# Altium schematic sheet ST_LINK_V2-1.SCHDOC: ST-LINK/V2-1
size A4; DocumentNumber: MB1248; Revision: A.2; SheetNumber: 11; SheetTotal: 14; Project: STM32H7-DK
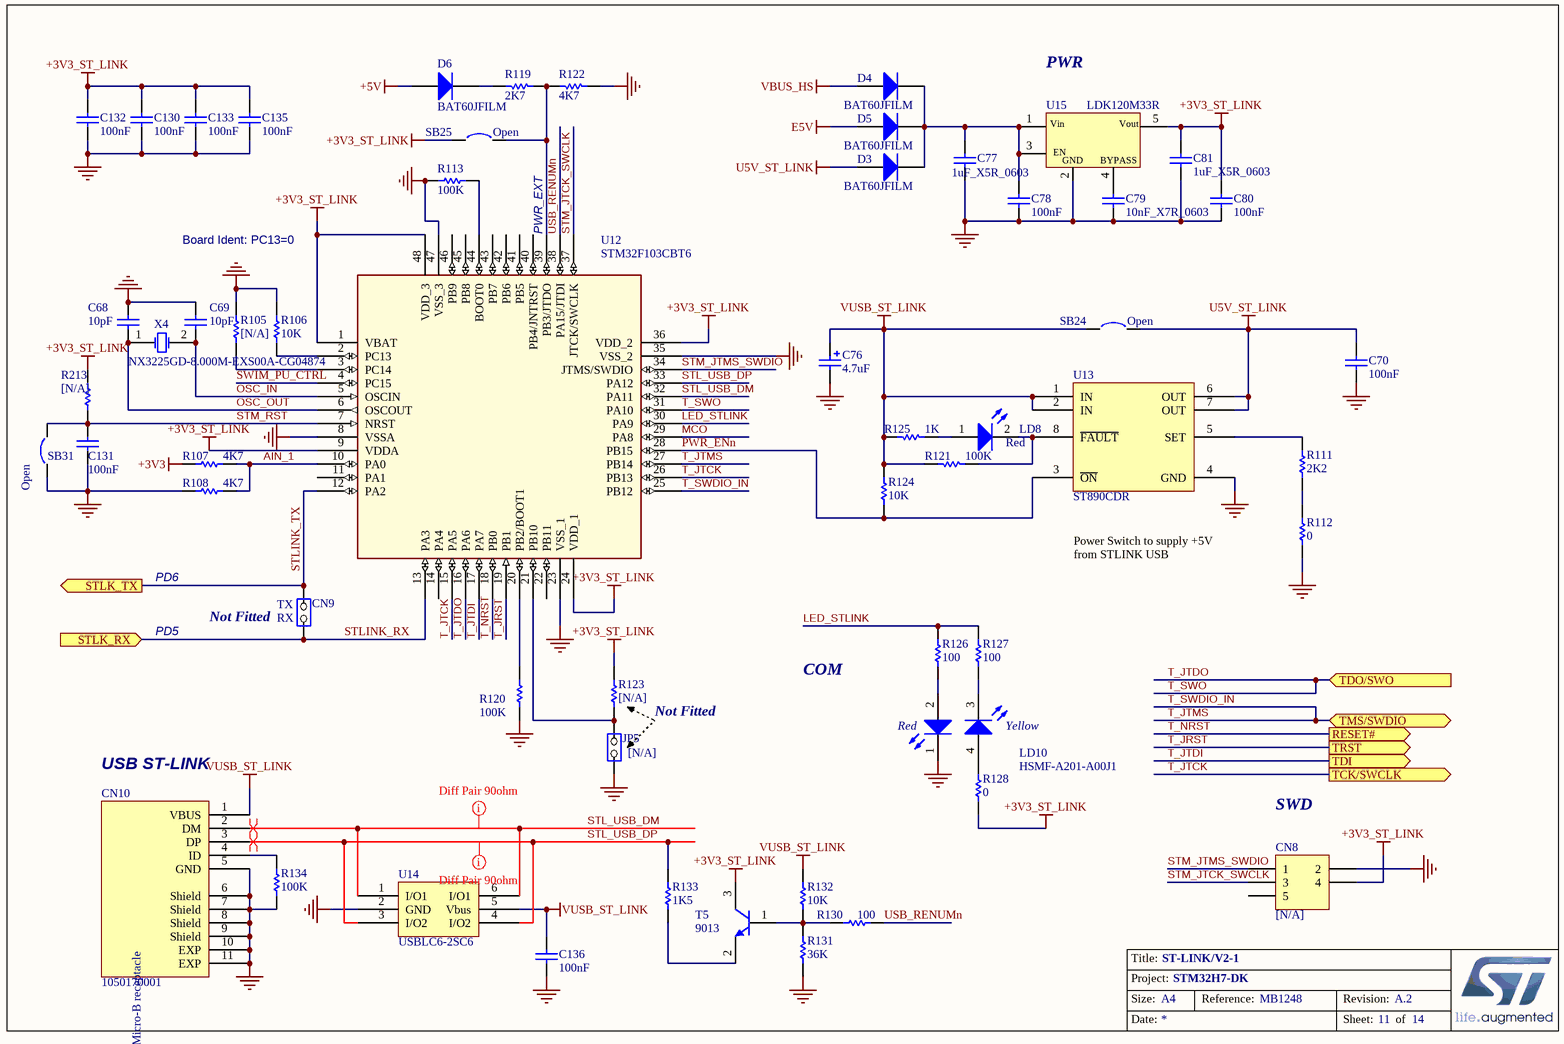
[diagram p0: ST_LINK_V2-1.SCHDOC]

## Parts
C68  10pF  [0603C]
C69  10pF  [0603C]
C70  100nF  [0603C]
C76  4.7uF  [TAN-A]
C77  1uF_X5R_0603  [0603C]
C78  100nF  [0603C]
C79  10nF_X7R_0603  [0603C]
C80  100nF  [0603C]
C81  1uF_X5R_0603  [0603C]
C130  100nF  [0603C]
C131  100nF  [0603C]
C132  100nF  [0603C]
C133  100nF  [0603C]
C135  100nF  [0603C]
C136  100nF  [0603C]
CN8  [N/A]  [HDR_2X3-1_2R54-6]
CN9  [N/A]  [SIP2]  (value not drawn)
CN10  1050170001  [MICRO_USB_B_105017]
D3  BAT60JFILM  [SOD-323]
D4  BAT60JFILM  [SOD-323]
D5  BAT60JFILM  [SOD-323]
D6  BAT60JFILM  [SOD-323]
JP5  [N/A]  [SIP2]
LD8  Red  [0603D]
LD10  HSMF-A201-A00J1  [LED2_3528]
R105  [N/A]  [0603R]
R106  10K  [0603R]
R107  4K7  [0603R]
R108  4K7  [0603R]
R111  2K2  [0402R]
R112  0  [0603R]
R113  100K  [0603R]
R119  2K7  [0603R]
R120  100K  [0603R]
R121  100K  [0603R]
R122  4K7  [0603R]
R123  [N/A]  [0603R]
R124  10K  [0402R]
R125  1K  [0603R]
R126  100  [0603R]
R127  100  [0603R]
R128  0  [0603R]
R130  100  [0603R]
R131  36K  [0603R]
R132  10K  [0603R]
R133  1K5  [0603R]
R134  100K  [0603R]
R213  [N/A]  [0603R]
SB24  Open  [SB_0603]
SB25  Open  [SB_0603]
SB31  Open  [SB_0603]
T5  9013  [SOT-23]
U12  STM32F103CBT6  [LQFP48_0R5_9X9]
U13  ST890CDR  [SOIC8_1R27_4R9X6]
U14  USBLC6-2SC6  [SOT23-6L]
U15  LDK120M33R  [SOT23-5]
X4  NX3225GD-8.000M-EXS00A-CG04874  [XTAL_2SM_3R2X2R5_H1]

## Ports
RESET# (out), STLK_RX (in), STLK_TX (out), TCK/SWCLK (out), TDI (out), TDO/SWO (in), TMS/SWDIO (bidir), TRST (out)

## Nets
+3V3: R107.1
+3V3_ST_LINK: C80.2 C81.1 C130.2 C132.2 C133.2 C135.2 CN8.4 R123.1 R128.2 R213.2 SB25.1 T5.3(C) U12.1(VBAT) U12.9(VDDA) U12.24(VDD_1) U12.36(VDD_2) U12.48(VDD_3) U15.5(Vout)
+5V: D6.1(A)
E5V: D5.1(A)
GND: C68.2 C69.2 C70.1 C76.2 C77.1 C78.1 C79.1 C80.1 C81.2 C130.1 C131.1 C132.1 C133.1 C135.1 C136.1 CN8.2 CN10.5(GND) CN10.6(Shield) CN10.7(Shield) CN10.8(Shield) CN10.9(Shield) CN10.10(EXP) CN10.11(EXP) JP5.1(COMMON) LD10.1(RED_cathode) R105.1 R106.1 R108.1 R112.1 R113.1 R120.1 R122.2 R131.1 R134.2 SB31.1 U12.8(VSSA) U12.23(VSS_1) U12.35(VSS_2) U12.47(VSS_3) U13.4(GND) U14.2(GND) U15.2(GND)
U5V_ST_LINK: C70.2 D3.1(A) SB24.2 U13.6(OUT) U13.7(OUT)
VBUS_HS: D4.1(A)
VUSB_ST_LINK: C76.1 C136.2 CN10.1(VBUS) R121.1 R124.1 R125.1 R132.2 SB24.1 U13.1(IN) U13.2(IN) U14.5(Vbus)
AIN_1: R107.2 R108.2 U12.10(PA0)
LED_STLINK: R126.1 R127.1 U12.30(PA9)
MCO: U12.29(PA8)
OSC_IN: C69.1 U12.5(OSCIN) X4.2(OSC2)
OSC_OUT: C68.1 U12.6(OSCOUT) X4.1(OSC1)
PWR_ENn: R124.2 U12.28(PB15) U13.3(~{ON})
STL_USB_DM: CN10.2(DM) U12.32(PA11) U14.1(I/O1) U14.6(I/O1)
STL_USB_DP: CN10.3(DP) R133.1 U12.33(PA12) U14.3(I/O2) U14.4(I/O2)
STLINK_RX: CN9.1(COMMON) U12.13(PA3) ; port STLK_RX
STLINK_TX: CN9.2(NO) U12.12(PA2) ; port STLK_TX
STM_JTCK_SWCLK: CN8.3 U12.37(JTCK/SWCLK)
STM_JTMS_SWDIO: CN8.1 U12.34(JTMS/SWDIO)
STM_RST: C131.2 R213.1 SB31.2 U12.7(NRST)
SWIM_PU_CTRL: U12.4(PC15)
T_JRST: U12.19(PB1) ; port TRST
T_JTCK: U12.15(PA5) U12.26(PB13) ; port TCK/SWCLK
T_JTDI: U12.17(PA7) ; port TDI
T_JTDO: U12.16(PA6) U12.31(PA10) ; port TDO/SWO  [also labelled T_SWO]
T_JTMS: U12.25(PB12) U12.27(PB14) ; port TMS/SWDIO  [also labelled T_SWDIO_IN]
T_NRST: U12.18(PB0) ; port RESET#
USB_RENUMn: R130.2 U12.38(PA15/JTDI)
NetC77_2: C77.2 C78.2 D3.2(K) D4.2(K) D5.2(K) U15.1(Vin) U15.3(CE)
NetC79_2: C79.2 U15.4(BYPASS)
NetCN10_4: CN10.4(ID) R134.1
NetD6_2: D6.2(K) R119.1
NetJP5_2: JP5.2(NO) R123.2 U12.21(PB10)
NetLD8_1: LD8.1(A) R125.2
NetLD8_2: LD8.2(K) R121.2 U13.8(~{FAULT})
NetLD10_2: LD10.2(Red_anode) R126.2
NetLD10_3: LD10.3(YellowGreen_cathode) R127.2
NetLD10_4: LD10.4(YellowGreen_anode) R128.1
NetR105_2: R105.2 U12.3(PC14)
NetR106_2: R106.2 U12.2(PC13)
NetR111_1: R111.1 R112.2
NetR111_2: R111.2 U13.5(SET)
NetR113_2: R113.2 U12.44(BOOT0)
NetR119_2: R119.2 R122.1 SB25.2 U12.39(PB3/JTDO)
NetR120_2: R120.2 U12.20(PB2/BOOT1)
NetR130_1: R130.1 R131.2 R132.1 T5.1(B)
NetR133_2: R133.2 T5.2(E)

Not connected (* = marked no-connect by the designer): CN8 5; U12 11(PA1) 14(PA4) 22(PB11) 40(PB4/JNTRST) 41(PB5) 42(PB6) 43(PB7) 45(PB8) 46(PB9)

## Layout directives
differential pair: (no net found under the mark)
mark named Diff Pair 90ohm: STL_USB_DM, STL_USB_DP

## Notes on the sheet
- PWR
- Board Ident: PC13=0
- (near U12) PWR_EXT
- PD6
- Power Switch to supply +5V from STLINK USB
- PD5
- (near CN9) Not Fitted
- (near CN9) TX
- (near CN9) RX
- Not Fitted
- COM
- (near CN10) USB ST-LINK
- SWD
- Title:
- Project:
- Size:
- Date:
- A4
- Reference:
- Sheet:
- Revision:
- of
- (in symbol 1050170001) USB_Micro-B receptacle
- (in symbol HSMF-A201-A00J1) Red; Yellow
- (in symbol LDK120M33R) EN

## Library data of the parts
C68 C69 = Capacitor_ST: Capacitor 0402 / 0603 / 0805; Value: 100nF; Revision: July-2002: Re-released for DXP Platform.
C70 C78 C80 C130-C133 C135 C136 = Capacitor_ST: Capacitor 0402 / 0603 / 0805; Revision: July-2002: Re-released for DXP Platform.; Value: 100nF
C76 = Cap Pol1: Polarized Capacitor (Radial); Value: 100pF; Ordered by: Subcon; Published: 8-Jun-2000; Revision: July-2002: Re-released for DXP Platform.; Publisher: Altium Limited
C77 C81 = CAP SMD 0603  X5R 1µF 25V 10%: 0603  X5R 1µF; Rated voltage: 25V; Tolerance: 10%; Manufacturer: *; Manufacturer P/N: *; Order code Farnell: 1288202RL; Value: 1µF; Power: *; Technology: X5R; Temperature  Factor: *; Temperature Max: +125°C; Temperature Min: -55°C; STS Code: *
C79 = CAP SMD 0603  X7R 10000PF 50V 10%: 0603  X7R 10NF; Order code RS: 2040779; Rated voltage: 50V; Tolerance: 10%; Order code Farnell: 7569548RL; Value: 10NF; Power: *; Technology: X7R; Temperature Factor: *; Temperature Min: -55°C; Temperature Max: +125°C; STS Code: *
CN8 = Header 3X2: Header, 3-Pin, Dual row; Revision: 17-Jul-2002: Re-released for DXP Platform.; Publisher: Altium Limited
CN9 = JP2: Fitted: NO
CN10 = 1050170001: Silkscreen: USB
D3-D5 = BAT60JFILM: Manuf_1: STM; Provided: ST; ECCN_US/EU: EAR99/NEC; Revision: July-2002: Re-released for DXP Platform.; Order: BAT60JFILM; Manuf_Part_1: BAT60JFILM; Distrib: ST
D6 = Diode: Default Diode; Code - JEDEC: DO-214-AB; Ordered by: STM; ECCN_US/EU: EAR99/NEC; Published: 8-Jun-2000; Revision: July-2002: Re-released for DXP Platform.; Publisher: Altium Limited
JP5 = JP2
LD8 = LED2: Typical RED, GREEN, YELLOW, AMBER GaAs LED; Published: 8-Jun-2000; Revision: July-2002: Re-released for DXP Platform.; Publisher: Altium Limited
R105 R107 R108 = Resistor_ST: Resistor 0402 / 0603 / 0805; Description: Resistor 0402 or 0603 or 0805; Value: 10K; Fitted: NO
R106 R124 = Resistor_ST: Resistor 0402 / 0603 / 0805; Description: Resistor 0402 or 0603 or 0805; Value: 10K
R111 R113 R120 R130 R133 R134 = Resistor_ST: Resistor 0402 / 0603 / 0805; Description: Resistor 0402 or 0603 or 0805; Value: 10K
R112 R119 R122 R123 R126-R128 R131 R132 = Res1: Resistor; Value: 1K; Published: 8-Jun-2000; Revision: July-2002: Re-released for DXP Platform.; Publisher: Altium Limited
R121 = Res1: Resistor; Value: 1K; Ordered by: Subcon; Published: 8-Jun-2000; Revision: July-2002: Re-released for DXP Platform.; Publisher: Altium Limited
R125 = Res1: Resistor; Ordered by: Subcon; Published: 8-Jun-2000; Revision: July-2002: Re-released for DXP Platform.; Publisher: Altium Limited; Value: 1K
R213 = Resistor_ST: Resistor 0402 / 0603 / 0805; Description: Resistor 0402 or 0603 or 0805; Value: 100K
SB24 SB25 SB31 = Circuit Breaker: Published: 24-Mar-1999; Revision: July-2002: Re-released for DXP Platform.; Publisher: Altium Limited
T5 = NPN: NPN Bipolar Transistor; Code - JEDEC: TO-226-AA; Published: 8-Jun-2000; Revision: July-2002: Re-released for DXP Platform.; Publisher: Altium Limited
U12 = STM32F103CBT6: Medium-density performance line ARM-based 32-bit MCU with 64KB Flash; Manuf_1: STM; Ref St: 9175981; Provided: ST; ECCN_US/EU: 3A991A2/NEC; Footprint: QFP48 7X7; Manuf_Part_1: STM32F103CBT6; Distrib: ST; Order: STM32F103CBT6
U15 = LDK120M33R: 200 mA low quiescent current very low noise LDO; Manuf_1: STM; Provided: ST; Description: Ultra low drop-low noise BiCMOS voltage, regulators low ESR capacitors compatible; Ref St: 9176161; ECCN_US/EU: EAR99/NEC; Manuf_Part_1: LDK120M33R; Distrib: ST; Order: LDK120M33R
X4 = XTAL: Crystal Oscillator; Published: 8-Jun-2000; LatestRevisionDate: 17-Jul-2002; LatestRevisionNote: Re-released for DXP Platform.; PackageReference: R38; Publisher: Altium Limited